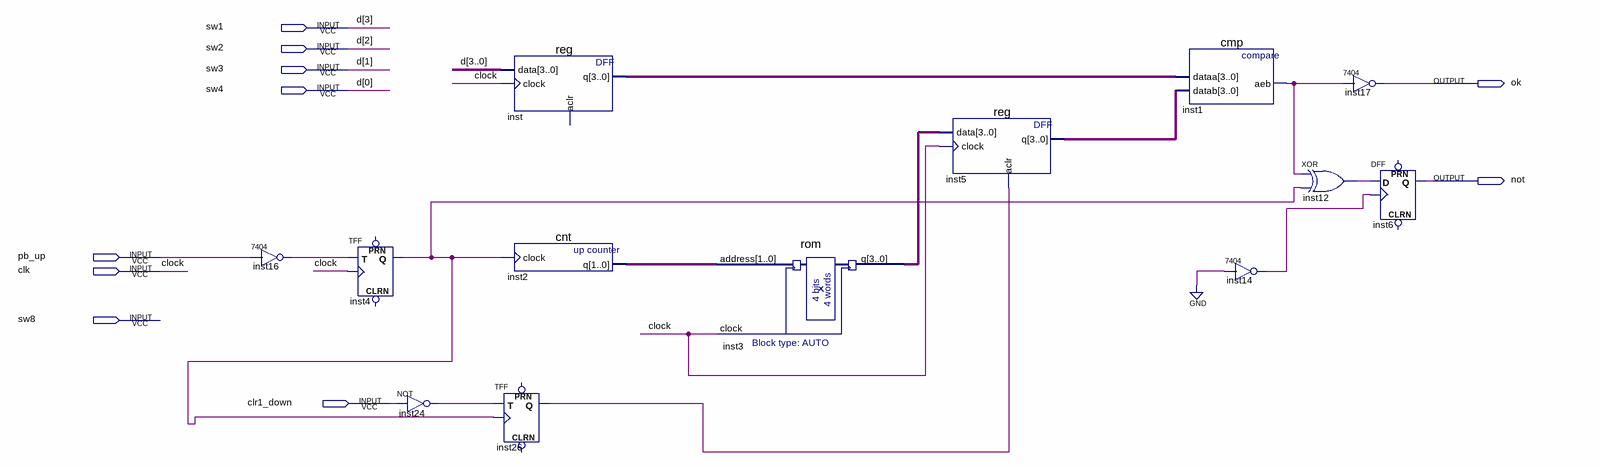
[diagram p0: schematic sheet]
// Quartus schematic OXPAHA.bdf as structural Verilog: 13 symbols, 10 pins
module OXPAHA (
  input  sw1,
  input  sw2,
  input  sw3,
  input  sw4,
  input  pb_up,
  input  clk,
  input  sw8,
  input  clr1_down,
  output ok,
  output \not 
);

  wire inst1_aeb, inst4_q, inst12_out, inst14_1, inst16_1, inst24_out, inst26_q;
  wire [1:0] inst2_q;
  wire [3:0] inst3_q, inst5_q, inst_q;

  \7404  inst16 (.\2 (pb_up), .\1 (inst16_1));
  TFF inst4 (.T(inst16_1), .CLK(clk), .Q(inst4_q));  // open: PRN, CLRN
  not inst24 (inst24_out, clr1_down);
  \reg  inst (.data({sw1, sw2, sw3, sw4}), .clock(clk), .q(inst_q));  // open: aclr
  cnt inst2 (.clock(inst4_q), .q(inst2_q));
  TFF inst26 (.T(inst24_out), .CLK(inst4_q), .Q(inst26_q));  // open: PRN, CLRN
  rom inst3 (.address(inst2_q), .clock(clk), .q(inst3_q));
  \reg  inst5 (.data(inst3_q), .clock(clk), .aclr(inst26_q), .q(inst5_q));
  cmp inst1 (.dataa(inst_q), .datab(inst5_q), .aeb(inst1_aeb));
  \7404  inst14 (.\2 (1'b0), .\1 (inst14_1));
  \7404  inst17 (.\2 (inst1_aeb), .\1 (ok));
  xor inst12 (inst12_out, inst1_aeb, inst4_q);
  DFF inst6 (.CLK(inst14_1), .D(inst12_out), .Q(\not ));  // open: CLRN, PRN

  // Other names for the same wires on the sheet: clock = clk; d[3:0] = {sw1, sw2, sw3, sw4}
endmodule
